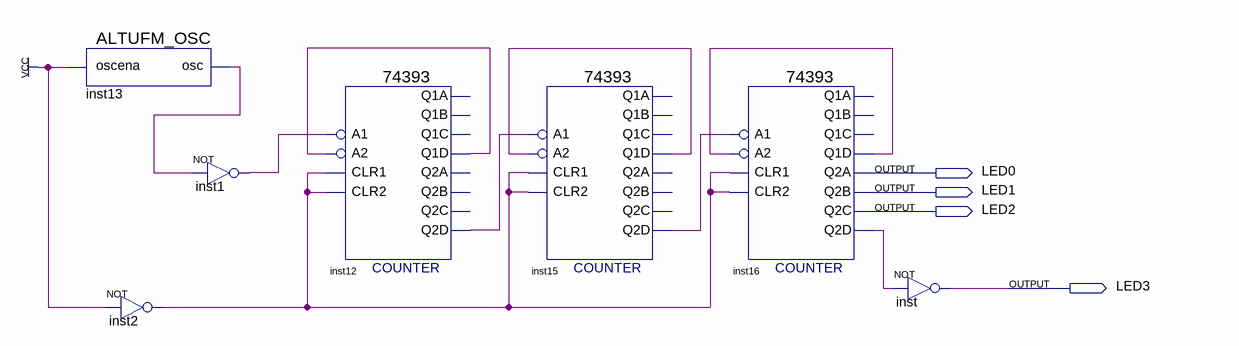
[diagram p0: schematic sheet]
// Quartus schematic max2.bdf as structural Verilog: 7 symbols, 4 pins
module max2 (
  output LED0,
  output LED1,
  output LED2,
  output LED3
);

  wire inst1_out, inst2_out, inst12_q1d, inst12_q2d, inst13_osc, inst15_q1d, inst15_q2d, inst16_q1d,
       inst16_q2d;

  ALTUFM_OSC inst13 (.oscena(1'b1), .osc(inst13_osc));
  not inst2 (inst2_out, 1'b1);
  not inst1 (inst1_out, inst13_osc);
  \74393  inst12 (
    .A1(inst1_out), .CLR1(inst2_out), .A2(inst12_q1d), .CLR2(inst2_out), .Q2D(inst12_q2d), .Q1D(inst12_q1d));  // open: Q2C, Q2B, Q1C, Q2A, Q1A, Q1B
  \74393  inst15 (
    .A1(inst12_q2d), .CLR1(inst2_out), .A2(inst15_q1d), .CLR2(inst2_out), .Q2D(inst15_q2d), .Q1D(inst15_q1d));  // open: Q2C, Q2B, Q1C, Q2A, Q1A, Q1B
  \74393  inst16 (
    .A1(inst15_q2d), .CLR1(inst2_out), .A2(inst16_q1d), .CLR2(inst2_out), .Q2D(inst16_q2d), .Q2C(LED2),
    .Q2B(LED1), .Q1D(inst16_q1d), .Q2A(LED0));  // open: Q1C, Q1A, Q1B
  not inst (LED3, inst16_q2d);
endmodule
